# Altium project Controll Board_PRJ.PrjPcb
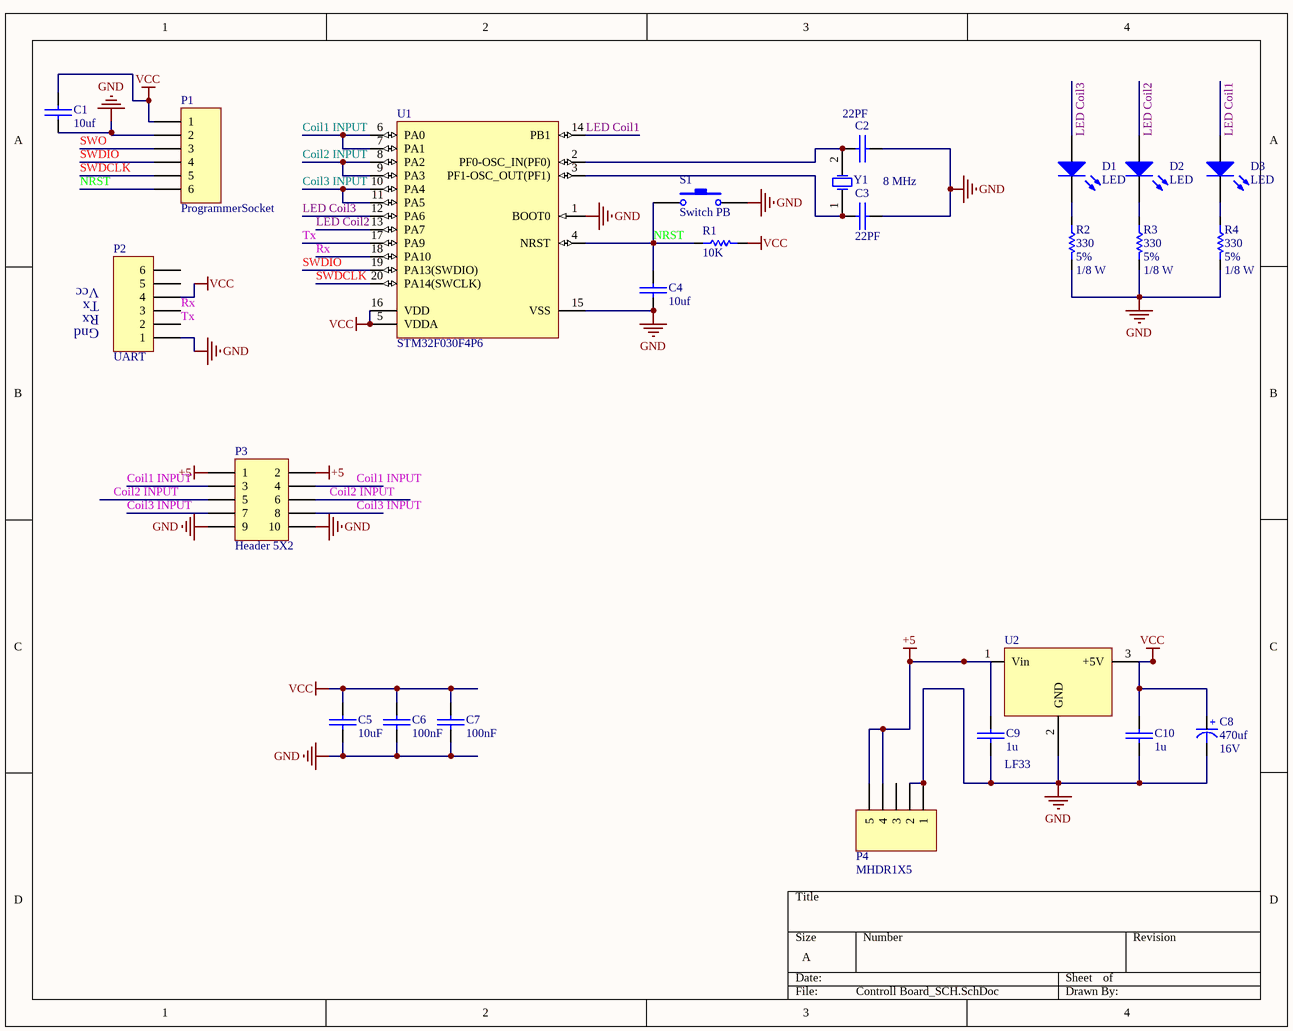
[diagram p0: Controll Board_SCH.SchDoc]
1 sheet, 25 parts. Net scope: global (net labels, ports and power ports of the same name join across sheets).
Board file: Controll Board_PCB.PcbDoc

## Sheet Controll Board_SCH.SchDoc
size A

### Parts
C1  10uf  [SMD_CAP_1206]
C2  22PF  [SMD_CAP_1206]
C3  22PF  [SMD_CAP_1206]
C4  10uf  [SMD_CAP_1206]
C5  10uF  [SMD_CAP_1206]
C6  100nF  [SMD_CAP_1206]
C7  100nF  [SMD_CAP_1206]
C8  Voltage: 16V  [cap 01]  (hidden comment: 470uf)
C9  1u  [SMD_CAP_1206]
C10  1u  [SMD_CAP_1206]
D1  LED  [My_LED3MM]
D2  LED  [My_LED3MM]
D3  LED  [My_LED3MM]
P1  ProgrammerSocket  [HDR1X6]
P2  UART  [HDR1X6]
P3  Header 5X2  [HDR2X5]
P4  MHDR1X5  [MHDR1X5]
R1  10K  [RES 1206 (3216X08L)]
R2  Tolerance: 5%  Power: 1/8 W  [RES 1206 (3216X08L)]  (hidden comment: 330)
R3  Tolerance: 5%  Power: 1/8 W  [RES 1206 (3216X08L)]  (hidden comment: 330)
R4  Tolerance: 5%  Power: 1/8 W  [RES 1206 (3216X08L)]  (hidden comment: 330)
S1  Switch PB  [Switch - Push to On]
U1  STM32F030F4P6  [STM-TSSOP20_N]
U2  LF33  [My_TO-220]
Y1  8 MHz  [XTAL Small]

### Nets
+5: C9.1(+) P3.1 P3.2 P4.4 P4.5 U2.1(Vin)
GND: C1.1(+) C2.2(-) C3.2(-) C4.1(+) C5.2(-) C6.2(-) C7.2(-) C8.2(-) C9.2(-) C10.2(-) P1.2 P2.1 P3.9 P3.10 P4.1 P4.2 R2.2 R3.2 R4.2 S1.2 U1.1(BOOT0) U1.15(VSS) U2.2(GND)
VCC: C1.2(-) C5.1(+) C6.1(+) C7.1(+) C8.1(+) C10.1(+) P1.1 P2.4 R1.2 U1.5(VDDA) U1.16(VDD) U2.3(+5V)
Coil1 INPUT: P3.3 P3.4 U1.6(PA0) U1.7(PA1)
Coil2 INPUT: P3.5 P3.6 U1.8(PA2) U1.9(PA3)
Coil3 INPUT: P3.7 P3.8 U1.10(PA4) U1.11(PA5)
LED Coil1: D3.A U1.14(PB1)
LED Coil2: D2.A U1.13(PA7)
LED Coil3: D1.A U1.12(PA6)
NRST: C4.2(-) P1.6 R1.1 S1.1 U1.4(NRST)
Rx: P2.3 U1.18(PA10)
SWDCLK: P1.5 U1.20(PA14(SWCLK))
SWDIO: P1.4 U1.19(PA13(SWDIO))
SWO: P1.3
Tx: P2.2 U1.17(PA9)
NetC2_1: C2.1(+) U1.2(PF0-OSC_IN(PF0)) Y1.2(OSC2)
NetC3_1: C3.1(+) U1.3(PF1-OSC_OUT(PF1)) Y1.1(OSC1)
NetD1_K: D1.K R2.1
NetD2_K: D2.K R3.1
NetD3_K: D3.K R4.1

Not connected (* = marked no-connect by the designer): P2 5 6; P4 3

### Notes on the sheet
- Rx
- Tx
- Vcc
- Gnd

### Library data of the parts
C1-C7 C9 C10 = Cap-Bipolar: Bipolar Capacitor; Voltage: 100V; Designer: Saeid Jorablo; Organazation: ControTec; Adding Date: 1387/12/20
  C1 C4: Value: 10uf
  C2 C3: Value: 22PF
  C5: Value: 10uF
  C6 C7: Value: 100nF
  C9 C10: Value: 1u
C8 = Cap-Polar: Polar Capacitor; Designer: Saeid Jorablo; Organazation: ControTec; Adding Date: 1387/12/20; Value: 470uf
D1-D3 = LED: Typical INFRARED GaAs LED; Published: 8-Jun-2000; LatestRevisionDate: 08-Jul-2005; LatestRevisionNote: Mech Layer 1 removed.; Publisher: Altium Limited
P1 P2 = Header 6: Header, 6-Pin; LatestRevisionDate: 17-Jul-2002; LatestRevisionNote: Re-released for DXP Platform.; Publisher: Altium Limited
P3 = Header 5X2: Header, 5-Pin, Dual row; LatestRevisionDate: 17-Jul-2002; LatestRevisionNote: Re-released for DXP Platform.; Publisher: Altium Limited
P4 = MHDR1X5: Header, 5-Pin; LatestRevisionDate: 17-Jul-2002; LatestRevisionNote: Re-released for DXP Platform.; Publisher: Altium Limited
R1 = Resistor: Tolerance: 1%; Power: 1/8 W; Value: 10K
R2-R4 = Resistor: Value: 330
S1 = Switch PB: Push Button Switch
U1 = STM32F030F4P6: ARM Cortex-M0 32-bit MCU, 16 KB Flash, 4 KB Internal RAM, 15 I/Os, 20-pin TSSOP, -40 to 85 degC, Tube; FLASH Size (Prog) (kB): 16; I/Os (High Current): 15; Internal RAM Size (kB): 4; Operating Frequency(F) (Processor speed) (MHz): 48; Supply Voltage(Vcc) min (V): 2.4; DatasheetVersion: Rev. 1; PackageVersion: Rev. 1, 11/2012; PackageReference: TSSOP20; PackageDescription: 20-Pin Thin Shrink Small Outline Package, 6.5 x 4.4 mm Body, 0.65 mm Pitch; Supplier 1: Digi-Key; Supplier Part Number 1: 497-14044-5-ND; Supplier 2: Newark; Supplier Part Number 2: 06X3648; Supplier 3: Mouser; Supplier Part Number 3: 511-STM32F030F4P6; Core: ARM Cortex-M0; Packing: Tube; Mounting Technology: Surface Mount; PartNumber: STM32F030F4P6; ComponentLink1Description: Manufacturer URL; ComponentLink1URL: http://www.st.com/web/en/home.html; ComponentLink2Description: Datasheet; ComponentLink2URL: http://www.st.com/st-web-ui/static/active/en/resource/technical/document/datasheet/DM00088500.pdf; ComponentLink3Description: Package Specification; ComponentLink3URL: http://www.st.com/st-web-ui/static/active/en/resource/technical/document/datasheet/DM00065136.pdf
U2 = 7805: Regulator
Y1 = XTAL: XTAL Crystal; Company: E.P.I.L; Design Date: 11/04/2011; Value: 8 MHz